# Altium schematic sheet FPGA.SchDoc
size A4
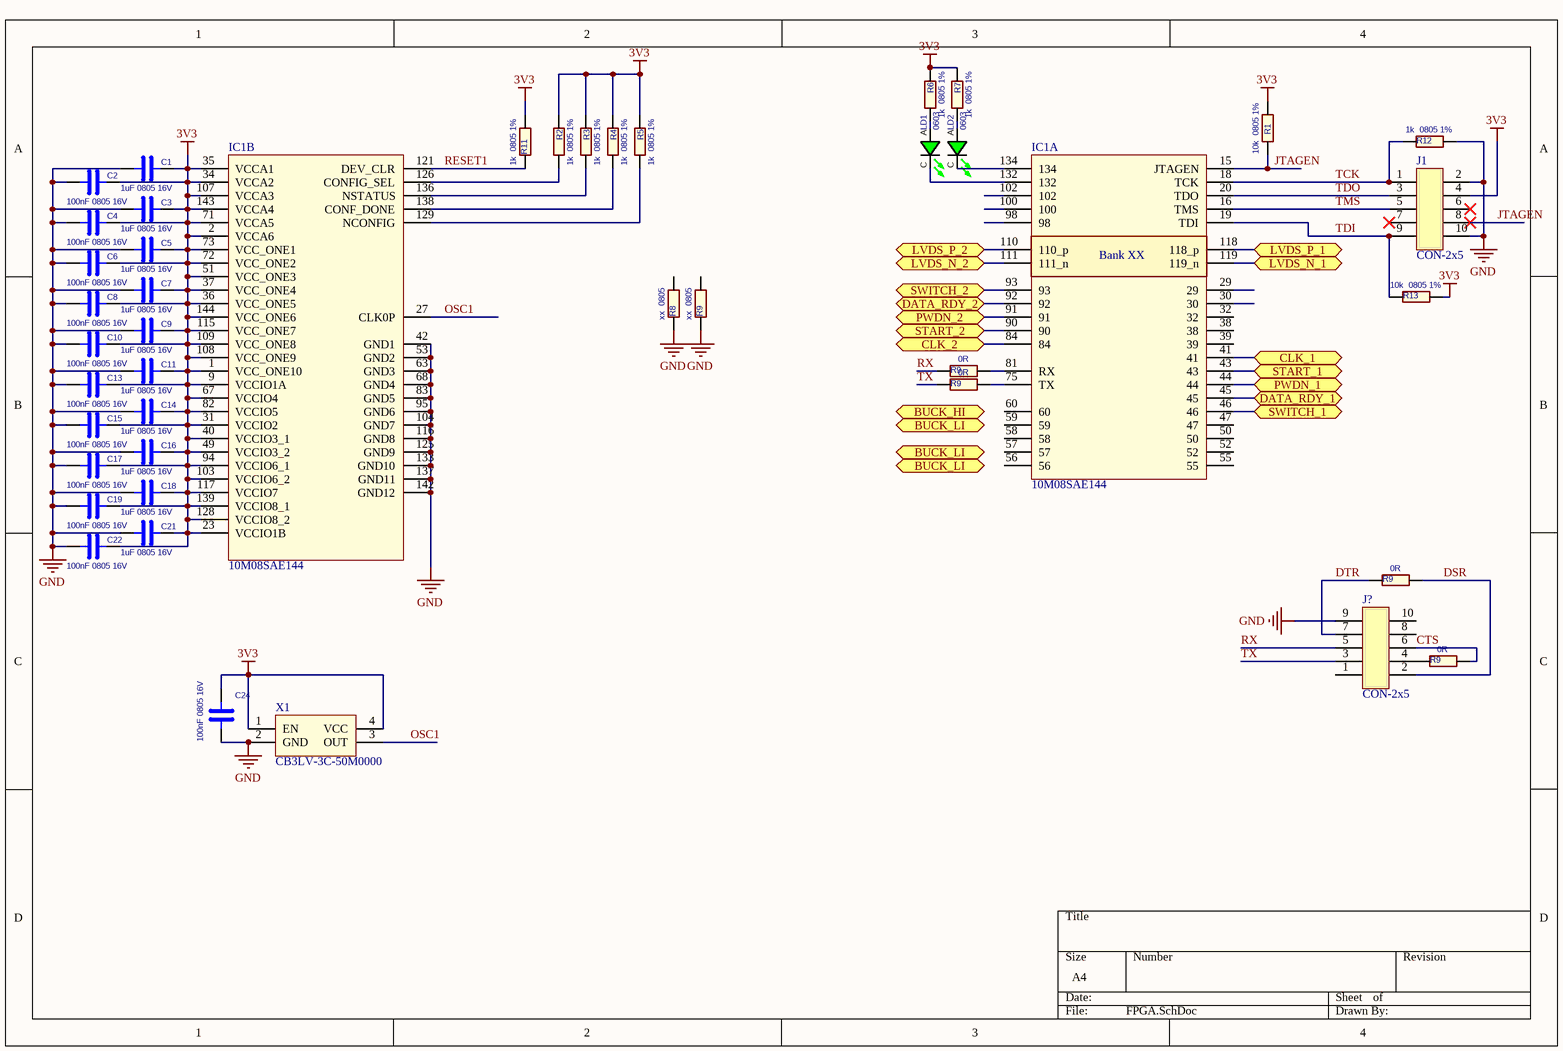
[diagram p0: FPGA.SchDoc]

## Parts
(Parts that share a designator on the sheet are numbered #1, #2 ... from top to bottom, then left to right.)
C1  1uF 0805 16V  [CAP-0805]
C2  100nF 0805 16V  [CAP-0805]
C3  1uF 0805 16V  [CAP-0805]
C4  100nF 0805 16V  [CAP-0805]
C5  1uF 0805 16V  [CAP-0805]
C6  100nF 0805 16V  [CAP-0805]
C7  1uF 0805 16V  [CAP-0805]
C8  100nF 0805 16V  [CAP-0805]
C9  1uF 0805 16V  [CAP-0805]
C10  100nF 0805 16V  [CAP-0805]
C11  1uF 0805 16V  [CAP-0805]
C13  100nF 0805 16V  [CAP-0805]
C14  1uF 0805 16V  [CAP-0805]
C15  100nF 0805 16V  [CAP-0805]
C16  1uF 0805 16V  [CAP-0805]
C17  100nF 0805 16V  [CAP-0805]
C18  1uF 0805 16V  [CAP-0805]
C19  100nF 0805 16V  [CAP-0805]
C21  1uF 0805 16V  [CAP-0805]
C22  100nF 0805 16V  [CAP-0805]
C24  100nF 0805 16V  [CAP-0805]
IC1  10M08SAE144  [SQFP50P2200X2200X200-144N]  (parts A,B of 2)
J1  CON-2x5  [PIN-2X5-2.54-1.0]
J?  CON-2x5  [PIN-2X5-2.54-1.0]
LD1  0603  [LED 0603 Green]
LD2  0603  [LED 0603 Green]
R1  10k  0805 1%  [RES-0805]
R2  1k  0805 1%  [RES-0805]
R3  1k  0805 1%  [RES-0805]
R4  1k  0805 1%  [RES-0805]
R5  1k  0805 1%  [RES-0805]
R6  1k  0805 1%  [RES-0805]
R7  1k  0805 1%  [RES-0805]
R8  xx  0805  [RES-0805]
R9#1  xx  0805  [RES-0805]
R9#2  0R  [RES-0805]
R9#3  0R  [RES-0805]
R9#4  0R  [RES-0805]
R9#5  0R  [RES-0805]
R11  1k  0805 1%  [RES-0805]
R12  1k  0805 1%  [RES-0805]
R13  10k  0805 1%  [RES-0805]
X1  CB3LV-3C-50M0000  [OSC]

## Ports
BUCK_HI (bidir), BUCK_LI (bidir), CLK_1 (bidir), CLK_2 (bidir), DATA_RDY_1 (bidir), DATA_RDY_2 (bidir), LVDS_N_1 (bidir), LVDS_N_2 (bidir), LVDS_P_1 (bidir), LVDS_P_2 (bidir), PWDN_1 (bidir), PWDN_2 (bidir), START_1 (bidir), START_2 (bidir), SWITCH_1 (bidir), SWITCH_2 (bidir)

## Nets
3V3: C1.1 C2.1 C3.1 C4.1 C5.1 C6.1 C7.1 C8.1 C9.1 C10.1 C11.1 C13.1 C14.1 C15.1 C16.1 C17.1 C18.1 C19.1 C21.1 C22.1 C24.1 IC1.1(VCC_ONE10) IC1.2(VCCA6) IC1.9(VCCIO1A) IC1.23(VCCIO1B) IC1.31(VCCIO2) IC1.34(VCCA2) IC1.35(VCCA1) IC1.36(VCC_ONE5) IC1.37(VCC_ONE4) IC1.40(VCCIO3_1) IC1.49(VCCIO3_2) IC1.51(VCC_ONE3) IC1.67(VCCIO4) IC1.71(VCCA5) IC1.72(VCC_ONE2) IC1.73(VCC_ONE1) IC1.82(VCCIO5) IC1.94(VCCIO6_1) IC1.103(VCCIO6_2) IC1.107(VCCA3) IC1.108(VCC_ONE9) IC1.109(VCC_ONE8) IC1.115(VCC_ONE7) IC1.117(VCCIO7) IC1.128(VCCIO8_2) IC1.139(VCCIO8_1) IC1.143(VCCA4) IC1.144(VCC_ONE6) J1.4(VCC) R1.2 R2.1 R3.1 R4.1 R5.1 R6.1 R7.1 R11.2 R13.2 X1.1(EN) X1.4(VCC)
GND: C1.2 C2.2 C3.2 C4.2 C5.2 C6.2 C7.2 C8.2 C9.2 C10.2 C11.2 C13.2 C14.2 C15.2 C16.2 C17.2 C18.2 C19.2 C21.2 C22.2 C24.2 IC1.42(GND1) IC1.53(GND2) IC1.63(GND3) IC1.68(GND4) IC1.83(GND5) IC1.95(GND6) IC1.104(GND7) IC1.116(GND8) IC1.125(GND9) IC1.133(GND10) IC1.137(GND11) IC1.142(GND12) J1.2(VCC) J1.10(VCC) J?.9(VCC) R8.1 R9#1.1 R12.2 X1.2(GND)
CLK_1: IC1.41 ; port CLK_1
CLK_2: IC1.84 ; port CLK_2
CTS: J?.6(VCC) R9#5.2
DATA_RDY_1: IC1.45 ; port DATA_RDY_1
DATA_RDY_2: IC1.92 ; port DATA_RDY_2
DSR: J?.2(VCC) R9#4.2
DTR: J?.7(VCC) R9#4.1
JTAGEN: IC1.15(JTAGEN) J1.8(VCC) R1.1
LVDS_N_1: IC1.119(119_n) ; port LVDS_N_1
LVDS_N_2: IC1.111(111_n) ; port LVDS_N_2
LVDS_P_1: IC1.118(118_p) ; port LVDS_P_1
LVDS_P_2: IC1.110(110_p) ; port LVDS_P_2
OSC1: IC1.27(CLK0P) X1.3(OUT)
PWDN_1: IC1.44 ; port PWDN_1
PWDN_2: IC1.91 ; port PWDN_2
RESET1: IC1.121(DEV_CLR) R11.1
RX: J?.5(VCC) R9#2.1
START_1: IC1.43 ; port START_1
START_2: IC1.90 ; port START_2
SWITCH_1: IC1.46 ; port SWITCH_1
SWITCH_2: IC1.93 ; port SWITCH_2
TCK: IC1.18(TCK) J1.1(VCC) R12.1
TDI: IC1.19(TDI) J1.9(VCC) R13.1
TDO: IC1.20(TDO) J1.3(VCC)
TMS: IC1.16(TMS) J1.5(VCC)
TX: J?.3(VCC) R9#3.1
NetIC1_75: IC1.75(TX) R9#3.2
NetIC1_81: IC1.81(RX) R9#2.2
NetIC1_126: IC1.126(CONFIG_SEL) R2.2
NetIC1_129: IC1.129(NCONFIG) R5.2
NetIC1_132: IC1.132 LD1.C(CATHODE)
NetIC1_134: IC1.134 LD2.C(CATHODE)
NetIC1_136: IC1.136(NSTATUS) R3.2
NetIC1_138: IC1.138(CONF_DONE) R4.2
NetJ?_4: J?.4(VCC) R9#5.1
NetLD1_A: LD1.A(ANODE) R6.2
NetLD2_A: LD2.A(ANODE) R7.2

Not connected (* = marked no-connect by the designer): IC1 29 30 32 38 39 47 50 52 55 56 57 58 59 60 98 100 102; J1 6(VCC)* 7(VCC)*; J? 1(VCC) 8(VCC) 10(VCC); R8 2; R9#1 2

## Notes on the sheet
- (in symbol 10M08SAE144_V2, part A) Bank XX

## Library data of the parts
C1-C11 C13-C19 C21 C22 C24 = 0805CAPxxrrrrv: CAP CER rrrrUF xV x% type 0805
IC1 = 10M08SAE144_V2: Manufacturer Part Number: 10M08SAE144C8G; Manufacturer: Intel; Supplier 1: Digi-Key; Supplier Part Number 1: 544-3132-ND
J1 J? = CONN-2x5: Manufacturer: Harwin Inc.; Manufacturer Part Number: M20-9970546
LD1 LD2 = LED_GRN_0603: 0603 GRN LED; Manufacturer 1: Osram Opto Semiconductor; Manufacturer Part Number 1: LG Q971-KN-1; Category 1: Standard LEDs - SMD; Description 1: Standard LEDs - SMD Green, 570nm 10mcd, 20mA; Illumination Colour: Green; Forward Current: 20 mA; Forward Voltage: 2.2 V; LED Size: 1.6 mm x 0.8 mm x 0.3 mm; Luminous Intensity: 10 mcd; Viewing Angle: 160 deg; Wavelength/Colour Temperature: 570 nm; Supplier 1: Mouser; Supplier Part Number 1: 720-LGQ971-KN-1; RoHS 1: RoHS Compliant; Package/Case: 0603; Packaging: Reel; Maximum Operating Temperature: + 85 C; Minimum Operating Temperature: - 40 C; Product Category: Standard LED - Surface Mount; Standard Pack Qty: 16000; RoHS - Mouser: Y; Minimum Order Quantity: 1; Reeling: True; ComponentLink1URL: http://catalog.osram-os.com/catalogue/catalogue.do;jsessionid=B82A462BB9500FF5EC02EA555C13E990?act=downloadFile&favOid=0200000600005069000100b6; ComponentLink1Description: http://catalog.osram-os.com/catalogue/catalogue.do;jsessionid=B82A462BB9500FF5EC02EA555C13E990?act=downloadFile&favOid=0200000600005069000100b6; Color: GRN
R1 R13 = CRCW080510K0FKEA: RES 10 KOHM 1/8W 1% 0805 SMD; Manufacturer 1: Vishay Dale; Description 1: RES SMD 10K OHM 1% 1/8W 0805; Category 1: Resistors; Power (Watts): 0.125W, 1/8W; Temperature Coefficient: ±100ppm/°C; Description 2: Thick Film Resistors - SMD 1/3watt 10Kohms 1% 100ppm High Power; Category 2: Thick Film Resistors - SMD; Power Rating: 330 mW; Resistance: 10 kOhms; Voltage Rating: 150 V; Brand: Vishay / Dale; Supplier 1: Digi-Key; Supplier Part Number 1: 541-10.0KCCT-ND; Manufacturer Part Number 1: CRCW080510K0FKEA; RoHS 1: RoHS Compliant; Packaging: Cut Tape (CT); Resistance (Ohms): 10k; Tolerance: ±1%; Composition: Thick Film; Features: Automotive AEC-Q200; Operating Temperature: -55°C ~ 155°C; Package / Case: 0805 (2012 Metric); Supplier Device Package: 0805 (2012 Metric); Size / Dimension: 0.079" L x 0.049" W (2.00mm x 1.25mm); Height: 0.020" (0.50mm); ComponentLink1URL: http://www.vishay.com/docs/20035/dcrcwe3.pdf; ComponentLink1Description: http://www.vishay.com/docs/20035/dcrcwe3.pdf; Supplier 2: Mouser; Supplier Part Number 2: 71-CRCW080510K0FKEAH; Manufacturer 2: Vishay; Manufacturer Part Number 2: CRCW080510K0FKEAHP; RoHS 2: RoHS Compliant By Exemption; Diameter: -; Length: 2 mm; Operating Temperature Range: - 55 C to + 155 C; Package/Case: 0805 (2012 metric); Product: Thick Film Resistors SMD; Series: CRCW-HP e3; Termination Style: SMD/SMT; Type: Pulse Proof, High Power Thick Film Chip Resistors; Width: 1.2 mm; Case Code - in: 0805; Case Code - mm: 2012; Product Category: 0805 Thick Film Chip Resistors; Standard Pack Qty: 5000; RoHS - Mouser: E; Minimum Order Quantity: 1; Reeling: True; ComponentLink2URL: http://www.mouser.com/ds/2/427/crcwhpe3-46056.pdf; ComponentLink2Description: http://www.mouser.com/ds/2/427/crcwhpe3-46056.pdf
R2-R7 R11 R12 = CRCW08051K00FKEA: RES 1 KOHM 1/8W 1% 0805 SMD; Manufacturer 1: Vishay Dale; Description 1: RES SMD 1K OHM 1% 1/8W 0805; Category 1: Resistors; Power (Watts): 0.125W, 1/8W; Temperature Coefficient: ±100ppm/°C; Description 2: Thick Film Resistors - SMD 1/8watt 1Kohms 1% 100ppm; Category 2: Thick Film Resistors - SMD; Power Rating: 125 mW (1/8 W); Resistance: 1 kOhms; Voltage Rating: 150 V; Brand: Vishay / Dale; Supplier 1: Digi-Key; Supplier Part Number 1: 541-1.00KCCT-ND; Manufacturer Part Number 1: CRCW08051K00FKEA; RoHS 1: RoHS Compliant; Packaging: Cut Tape (CT); Resistance (Ohms): 1k; Tolerance: ±1%; Composition: Thick Film; Features: Automotive AEC-Q200; Operating Temperature: -55°C ~ 155°C; Package / Case: 0805 (2012 Metric); Supplier Device Package: 0805 (2012 Metric); Size / Dimension: 0.079" L x 0.049" W (2.00mm x 1.25mm); Height: 0.020" (0.50mm); ComponentLink1URL: http://www.vishay.com/docs/20035/dcrcwe3.pdf; ComponentLink1Description: http://www.vishay.com/docs/20035/dcrcwe3.pdf; Supplier 2: Mouser; Supplier Part Number 2: 71-CRCW0805-1.0K-E3; Manufacturer 2: Vishay; Manufacturer Part Number 2: CRCW08051K00FKEA; RoHS 2: RoHS Compliant By Exemption; Length: 2 mm; Operating Temperature Range: - 55 C to + 155 C; Package/Case: 0805 (2012 metric); Product: Thick Film Resistors SMD; Series: CRCW; Termination Style: SMD/SMT; Width: 1.25 mm; Case Code - in: 0805; Case Code - mm: 2012; Product Category: 0805 Thick Film Chip Resistors; Standard Pack Qty: 5000; RoHS - Mouser: E; Minimum Order Quantity: 1; Reeling: True; ComponentLink2URL: http://www.mouser.com/ds/2/427/dcrcwe3-109170.pdf; ComponentLink2Description: http://www.mouser.com/ds/2/427/dcrcwe3-109170.pdf
R8 R9#1-R9#5 = CRCW0805xxxxJN Default: RES xx OHM 1/8W 5% 0805 SMD; Category 1: Resistors
X1 = CB3LV-3C-50M0000: Manufacturer: CTS-Frequency Controls; Supplier 1: Digi-Key; Supplier Part Number 1: CTX283LVCT-ND; Manufacturer Part Number: CB3LV-3C-50M0000